# EAGLE design display (EAGLE 6.6.0)
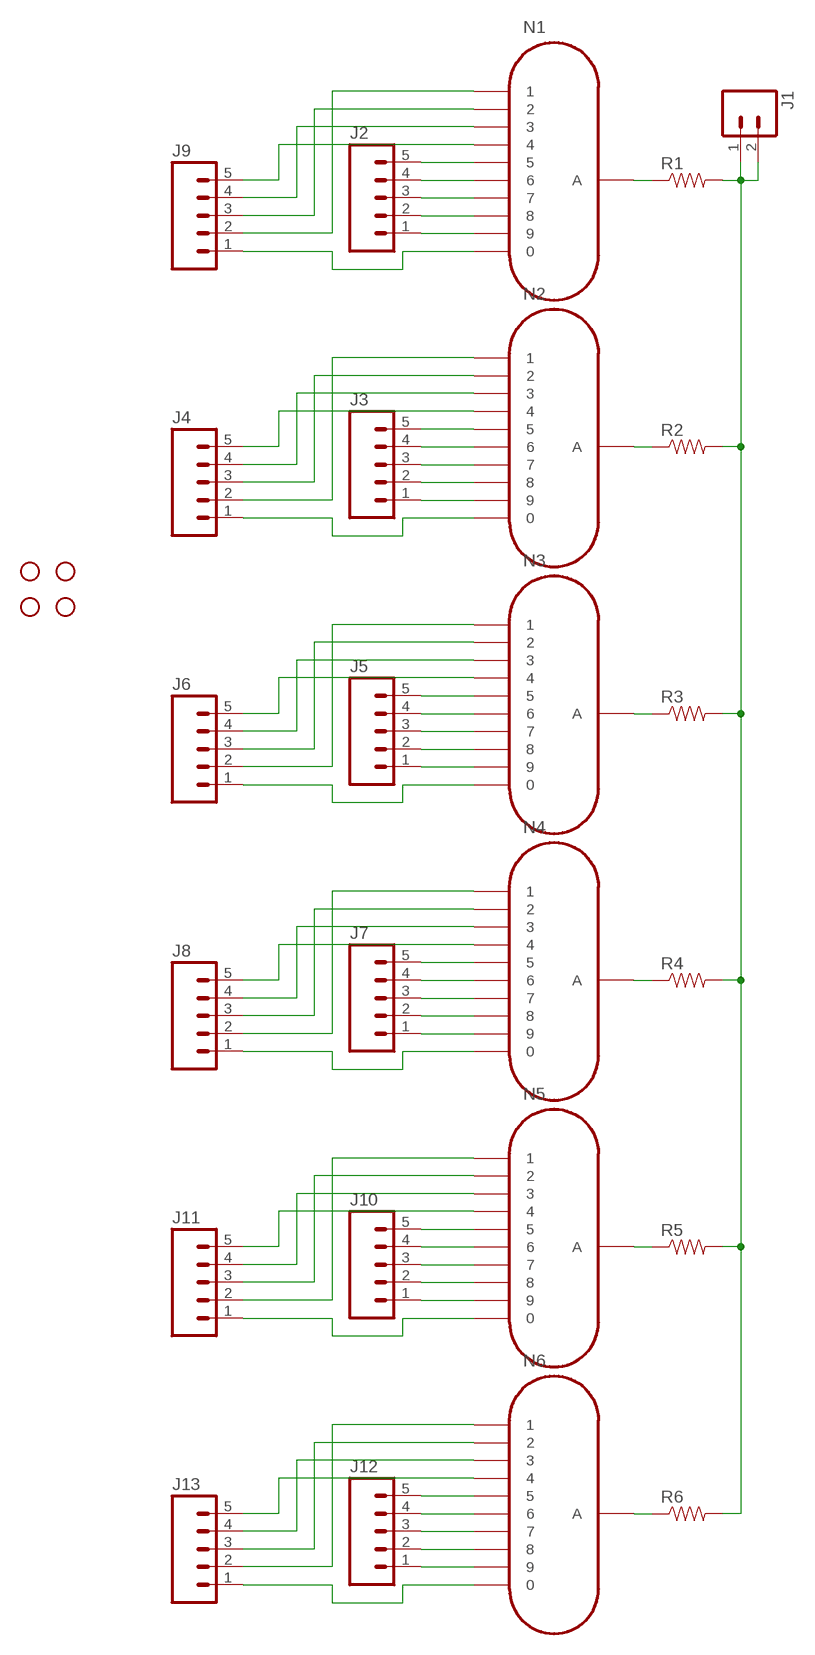
[diagram p0: schematic, sheet 1]

## Parts
H1  STAND-OFF  [STAND-OFF]
H2  STAND-OFF  [STAND-OFF]
H3  STAND-OFF  [STAND-OFF]
H4  STAND-OFF  [STAND-OFF]
J1  M02PTH  [1X02]
J2  M05PTH  [1X05]
J3  M05PTH  [1X05]
J4  M05PTH  [1X05]
J5  M05PTH  [1X05]
J6  M05PTH  [1X05]
J7  M05PTH  [1X05]
J8  M05PTH  [1X05]
J9  M05PTH  [1X05]
J10  M05PTH  [1X05]
J11  M05PTH  [1X05]
J12  M05PTH  [1X05]
J13  M05PTH  [1X05]
N1  IN-12A  [IN-12]
N2  IN-12A  [IN-12]
N3  IN-12A  [IN-12]
N4  IN-12A  [IN-12]
N5  IN-12A  [IN-12]
N6  IN-12A  [IN-12]
R1  RESISTOR0805-RES  [0805]
R2  RESISTOR0805-RES  [0805]
R3  RESISTOR0805-RES  [0805]
R4  RESISTOR0805-RES  [0805]
R5  RESISTOR0805-RES  [0805]
R6  RESISTOR0805-RES  [0805]

## Nets
N$1: J4.1 N2.0
N$2: J3.1 N2.9
N$3: J3.2 N2.8
N$4: J3.3 N2.7
N$5: J3.4 N2.6
N$6: J4.3 N2.2
N$7: J4.4 N2.3
N$8: J4.5 N2.4
N$9: J3.5 N2.5
N$10: J4.2 N2.1
N$11: J2.1 N1.9
N$12: J2.2 N1.8
N$13: J2.3 N1.7
N$14: J2.4 N1.6
N$15: J2.5 N1.5
N$16: J9.2 N1.1
N$17: J9.3 N1.2
N$18: J9.4 N1.3
N$19: J9.5 N1.4
N$20: J9.1 N1.0
N$21: J6.1 N3.0
N$22: J5.1 N3.9
N$23: J5.2 N3.8
N$24: J5.3 N3.7
N$25: J5.4 N3.6
N$26: J5.5 N3.5
N$27: J6.2 N3.1
N$28: J6.3 N3.2
N$29: J6.4 N3.3
N$30: J6.5 N3.4
N$31: J8.1 N4.0
N$32: J7.1 N4.9
N$33: J7.2 N4.8
N$34: J7.3 N4.7
N$35: J7.4 N4.6
N$36: J7.5 N4.5
N$37: J8.2 N4.1
N$38: J8.3 N4.2
N$39: J8.4 N4.3
N$40: J8.5 N4.4
N$41: J11.1 N5.0
N$42: J10.1 N5.9
N$43: J10.2 N5.8
N$44: J10.3 N5.7
N$45: J10.4 N5.6
N$46: J10.5 N5.5
N$47: J11.2 N5.1
N$48: J11.3 N5.2
N$49: J11.4 N5.3
N$50: J11.5 N5.4
N$51: J13.1 N6.0
N$52: J12.1 N6.9
N$53: J12.2 N6.8
N$54: J12.3 N6.7
N$55: J12.4 N6.6
N$56: J12.5 N6.5
N$57: J13.2 N6.1
N$58: J13.3 N6.2
N$59: J13.4 N6.3
N$60: J13.5 N6.4
N$61: N1.A R1.1
N$62: N2.A R2.1
N$63: N3.A R3.1
N$64: N4.A R4.1
N$65: N5.A R5.1
N$66: N6.A R6.1
N$67: J1.1 J1.2 R1.2 R2.2 R3.2 R4.2 R5.2 R6.2

## Library data of the parts
H1-H4 = SparkFun-Electromechanical:STAND-OFF: #4 Stand Off This is the mechanical footprint for a #4 phillips button head screw. Use the keepout ring to avoid running the screw head into surrounding components. SKU : PRT-00447
J1 = SparkFun-Connectors:M02: Standard 2-pin 0.1" header. Use with - straight break away headers ( PRT-00116) - right angle break away headers (PRT-00553) - swiss pins (PRT-00743) - machine pins (PRT-00117) - female headers (PRT-00115) Molex polarized connector foot print use with: PRT-08233 with associated crimp pins and housings. 2.54_SCREWTERM for use with PRT-10571. 3.5mm Screw Terminal footprints for PRT-08084 5mm Screw Terminal footprints for use with PRT-08432
J2-J13 = SparkFun-Connectors:M05: Header 5 Standard 5-pin 0.1" header. Use with straight break away headers (SKU : PRT-00116), right angle break away headers (PRT-00553), swiss pins (PRT-00743), machine pins (PRT-00117), and female headers (PRT-00115). Molex polarized connector foot print use with SKU : PRT-08230 with associated crimp pins and housings.
N1-N6 = russian-nixies:IN-12A: IN-12A: medium numeric topview nixie tube
R1-R6 = SparkFun-Passives:RESISTOR: Resistor Basic schematic elements and footprints for 0603, 1206, and PTH resistors.

## Board
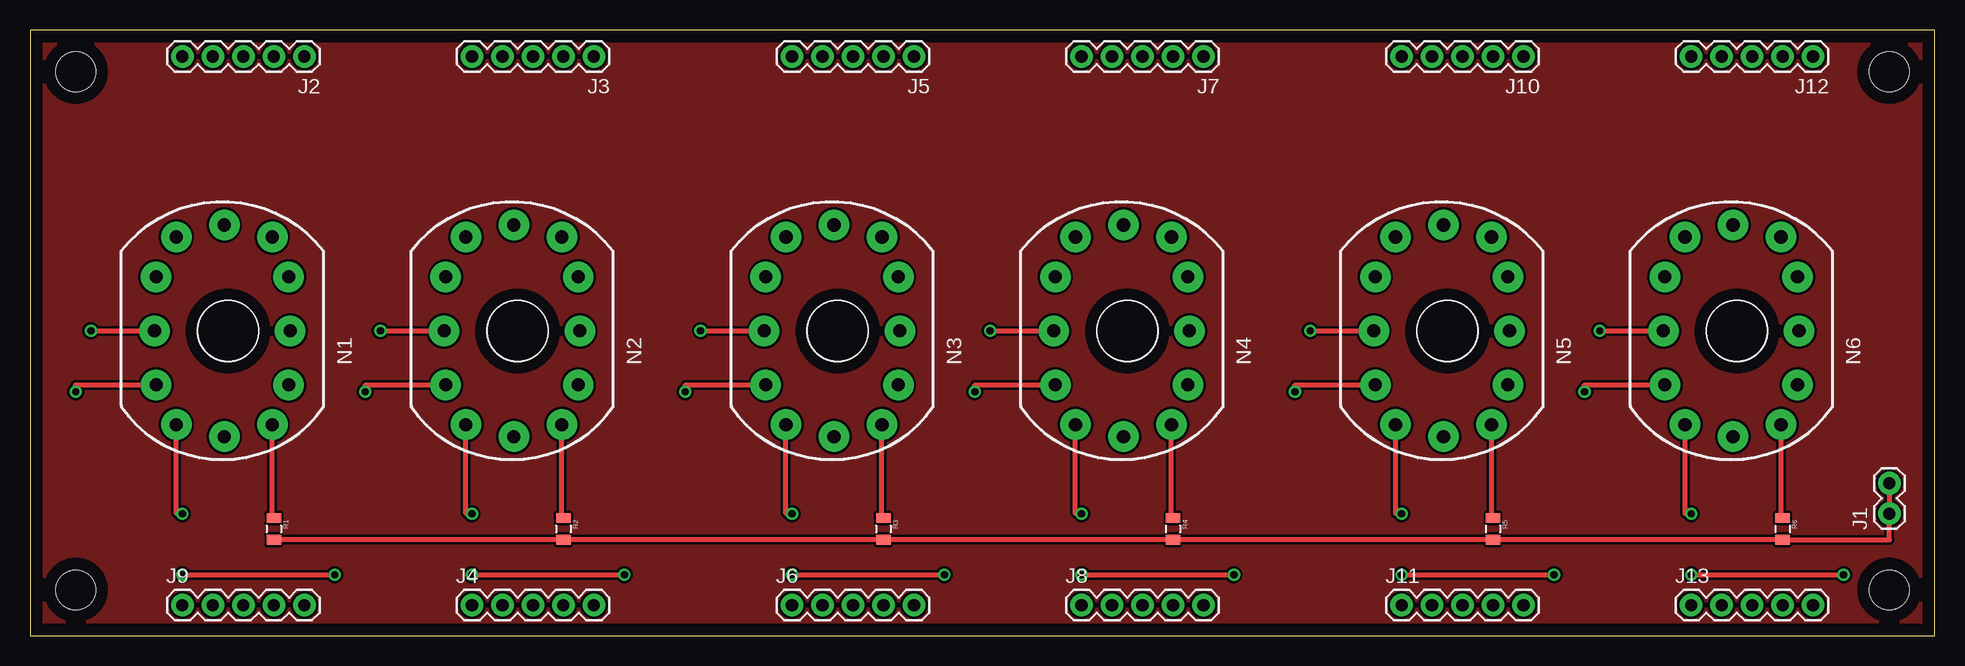
[diagram p1: board, top side]
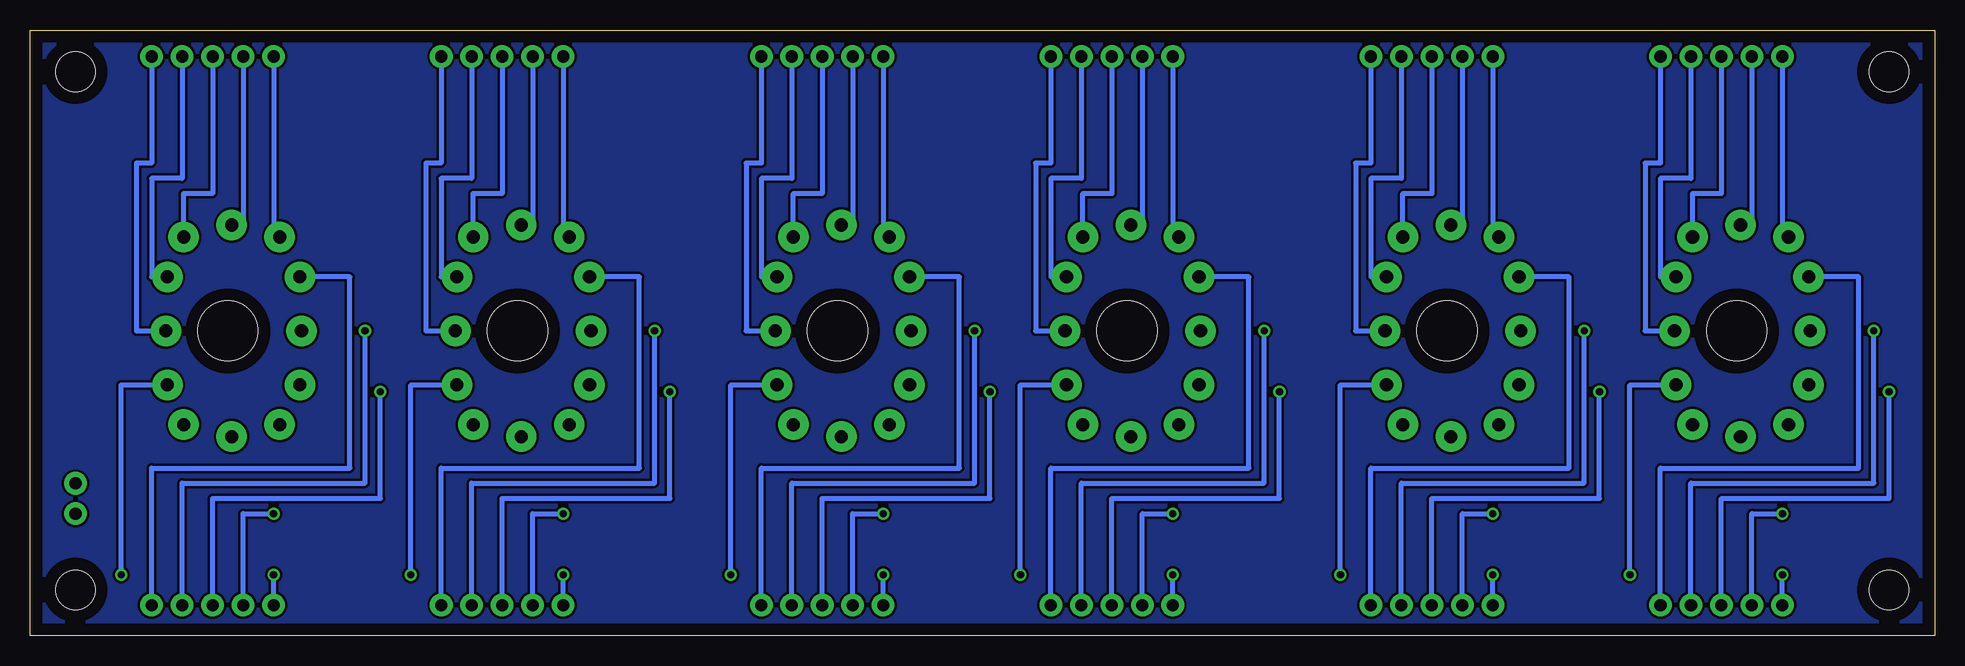
[diagram p2: board, bottom side, seen from below]

Size 158.73 x 50.47 mm. Coordinates in mm from the lower left corner, seen from the top.
Outline: 0,0 158.73,0 158.73,50.47 0,50.47 0,0
Copper layers (1*16): Top 0.035mm / dielectric 1.5mm / Bottom 0.035mm
Design rules "default": minimum track width 10mil, minimum drill 24mil, track to track 8mil, track to pad 8mil, pad to pad 8mil, via to via 8mil, smd to smd 8mil, copper to edge 40mil, drill to drill 8mil, minimum pad ring 10mil, minimum via ring 8mil, stop-mask expansion 4mil, vias tented up to drill 0mil, thermal gap 10mil

### Footprints (pad centres in the part's own frame; a part is rotated, then mirrored left to right if it is on the bottom)
STAND-OFF = hole 3.302: 0,0
1X02 = drill 1.016 pad 1.88: 1 0,0; 2 2.54,0
1X05 = drill 1.016 pad 1.88: 1 0,0; 2 2.54,0; 3 5.08,0; 4 7.62,0; 5 10.16,0
IN-12 = drill 1.1 pad 2.54: 0 5.048,-4.5; 1 -4.317,-7.817; 2 -6,-4.5; 3 -6.127,0; 4 -6,4.5; 5 -4.317,7.817; 6 -0.318,8.818; 7 3.683,7.817; 8 5.048,4.5; 9 5.175,0; A 3.683,-7.817; LHDP -0.318,-8.818 | hole 5: 0,0
0805 = smd 0.8 x 1.2: 1 -0.9,0; 2 0.9,0

### Placement (x,y rotation side)
H1  3.81,3.81 0 top
H2  154.94,46.99 0 top
H3  154.94,3.81 0 top
H4  3.81,46.99 0 top
J1  154.94,10.16 90 top
J2  22.86,48.26 180 top
J3  46.99,48.26 180 top
J4  36.83,2.54 0 top
J5  73.66,48.26 180 top
J6  63.5,2.54 0 top
J7  97.79,48.26 180 top
J8  87.63,2.54 0 top
J9  12.7,2.54 0 top
J10  124.46,48.26 180 top
J11  114.3,2.54 0 top
J12  148.59,48.26 180 top
J13  138.43,2.54 0 top
N1  16.51,25.4 0 top
N2  40.64,25.4 0 top
N3  67.31,25.4 0 top
N4  91.44,25.4 0 top
N5  118.11,25.4 0 top
N6  142.24,25.4 0 top
R1  20.32,8.89 270 top
R2  44.45,8.89 270 top
R3  71.12,8.89 270 top
R4  95.25,8.89 270 top
R5  121.92,8.89 270 top
R6  146.05,8.89 270 top

### Tracks (layer width: path | path; a pad name or v marks a point on that pad's centre or on a via)
GND
  pour Bottom: 0,0 158.75,0 158.75,50.8 0,50.8
N$1  (via drill 0.61)
  Top 0.406: v36.83,5.08 v49.53,5.08
  Bottom 0.406: J4.1 v36.83,5.08 | v49.53,5.08 49.53,20.9 N2.0
N$2
  Bottom 0.406: J3.1 46.99,39.37 48.26,39.37 48.26,25.4 N2.9
N$3
  Bottom 0.406: J3.2 44.45,38.1 46.99,38.1 46.99,29.9 N2.8
N$4
  Bottom 0.406: J3.3 41.91,36.83 44.32,36.83 N2.7
N$5
  Bottom 0.406: J3.4 39.37,34.22 N2.6
N$6  (via drill 0.61)
  Top 0.406: v27.94,20.32 27.94,20.9 N2.2
  Bottom 0.406: J4.3 41.91,11.43 27.94,11.43 v27.94,20.32
N$7  (via drill 0.61)
  Top 0.406: v29.21,25.4 N2.3
  Bottom 0.406: J4.4 44.45,12.7 29.21,12.7 v29.21,25.4
N$8
  Bottom 0.406: J4.5 46.99,13.97 30.48,13.97 30.48,29.9 N2.4
N$9
  Bottom 0.406: J3.5 36.83,33.22 N2.5
N$10  (via drill 0.61)
  Top 0.406: v36.83,10.16 36.32,10.16 N2.1
  Bottom 0.406: J4.2 39.37,10.16 v36.83,10.16
N$11
  Bottom 0.406: J2.1 22.86,39.37 24.13,39.37 24.13,25.4 N1.9
N$12
  Bottom 0.406: J2.2 20.32,38.1 22.86,38.1 22.86,29.9 N1.8
N$13
  Bottom 0.406: J2.3 17.78,36.83 20.19,36.83 N1.7
N$14
  Bottom 0.406: J2.4 15.24,34.22 N1.6
N$15
  Bottom 0.406: J2.5 12.7,33.22 N1.5
N$16  (via drill 0.61)
  Top 0.406: v12.7,10.16 12.19,10.16 N1.1
  Bottom 0.406: J9.2 15.24,10.16 v12.7,10.16
N$17  (via drill 0.61)
  Top 0.406: v3.81,20.32 3.81,20.9 N1.2
  Bottom 0.406: J9.3 17.78,11.43 3.81,11.43 v3.81,20.32
N$18  (via drill 0.61)
  Top 0.406: v5.08,25.4 N1.3
  Bottom 0.406: J9.4 20.32,12.7 5.08,12.7 v5.08,25.4
N$19
  Bottom 0.406: J9.5 22.86,13.97 6.35,13.97 6.35,29.9 N1.4
N$20  (via drill 0.61)
  Top 0.406: v12.7,5.08 v25.4,5.08
  Bottom 0.406: J9.1 v12.7,5.08 | v25.4,5.08 25.4,20.9 N1.0
N$21  (via drill 0.61)
  Top 0.406: v63.5,5.08 v76.2,5.08
  Bottom 0.406: J6.1 v63.5,5.08 | v76.2,5.08 76.2,20.9 N3.0
N$22
  Bottom 0.406: J5.1 73.66,39.37 74.93,39.37 74.93,25.4 N3.9
N$23
  Bottom 0.406: J5.2 71.12,38.1 73.66,38.1 73.66,29.9 N3.8
N$24
  Bottom 0.406: J5.3 68.58,36.83 70.99,36.83 N3.7
N$25
  Bottom 0.406: J5.4 66.04,34.22 N3.6
N$26
  Bottom 0.406: J5.5 63.5,33.22 N3.5
N$27  (via drill 0.61)
  Top 0.406: v63.5,10.16 62.99,10.16 N3.1
  Bottom 0.406: J6.2 66.04,10.16 v63.5,10.16
N$28  (via drill 0.61)
  Top 0.406: v54.61,20.32 54.61,20.9 N3.2
  Bottom 0.406: J6.3 68.58,11.43 54.61,11.43 v54.61,20.32
N$29  (via drill 0.61)
  Top 0.406: v55.88,25.4 N3.3
  Bottom 0.406: J6.4 71.12,12.7 55.88,12.7 v55.88,25.4
N$30
  Bottom 0.406: J6.5 73.66,13.97 57.15,13.97 57.15,29.9 N3.4
N$31  (via drill 0.61)
  Top 0.406: v87.63,5.08 v100.33,5.08
  Bottom 0.406: J8.1 v87.63,5.08 | v100.33,5.08 100.33,20.9 N4.0
N$32
  Bottom 0.406: J7.1 97.79,39.37 99.06,39.37 99.06,25.4 N4.9
N$33
  Bottom 0.406: J7.2 95.25,38.1 97.79,38.1 97.79,29.9 N4.8
N$34
  Bottom 0.406: J7.3 92.71,36.83 95.12,36.83 N4.7
N$35
  Bottom 0.406: J7.4 90.17,34.22 N4.6
N$36
  Bottom 0.406: J7.5 87.63,33.22 N4.5
N$37  (via drill 0.61)
  Top 0.406: v87.63,10.16 87.12,10.16 N4.1
  Bottom 0.406: J8.2 90.17,10.16 v87.63,10.16
N$38  (via drill 0.61)
  Top 0.406: v78.74,20.32 78.74,20.9 N4.2
  Bottom 0.406: J8.3 92.71,11.43 78.74,11.43 v78.74,20.32
N$39  (via drill 0.61)
  Top 0.406: v80.01,25.4 N4.3
  Bottom 0.406: J8.4 95.25,12.7 80.01,12.7 v80.01,25.4
N$40
  Bottom 0.406: J8.5 97.79,13.97 81.28,13.97 81.28,29.9 N4.4
N$41  (via drill 0.61)
  Top 0.406: v114.3,5.08 v127,5.08
  Bottom 0.406: J11.1 v114.3,5.08 | v127,5.08 127,20.9 N5.0
N$42
  Bottom 0.406: J10.1 124.46,39.37 125.73,39.37 125.73,25.4 N5.9
N$43
  Bottom 0.406: J10.2 121.92,38.1 124.46,38.1 124.46,29.9 N5.8
N$44
  Bottom 0.406: J10.3 119.38,36.83 121.79,36.83 N5.7
N$45
  Bottom 0.406: J10.4 116.84,34.22 N5.6
N$46
  Bottom 0.406: J10.5 114.3,33.22 N5.5
N$47  (via drill 0.61)
  Top 0.406: v114.3,10.16 113.79,10.16 N5.1
  Bottom 0.406: J11.2 116.84,10.16 v114.3,10.16
N$48  (via drill 0.61)
  Top 0.406: v105.41,20.32 105.41,20.9 N5.2
  Bottom 0.406: J11.3 119.38,11.43 105.41,11.43 v105.41,20.32
N$49  (via drill 0.61)
  Top 0.406: v106.68,25.4 N5.3
  Bottom 0.406: J11.4 121.92,12.7 106.68,12.7 v106.68,25.4
N$50
  Bottom 0.406: J11.5 124.46,13.97 107.95,13.97 107.95,29.9 N5.4
N$51  (via drill 0.61)
  Top 0.406: v138.43,5.08 v151.13,5.08
  Bottom 0.406: J13.1 v138.43,5.08 | v151.13,5.08 151.13,20.9 N6.0
N$52
  Bottom 0.406: J12.1 148.59,39.37 149.86,39.37 149.86,25.4 N6.9
N$53
  Bottom 0.406: J12.2 146.05,38.1 148.59,38.1 148.59,29.9 N6.8
N$54
  Bottom 0.406: J12.3 143.51,36.83 145.92,36.83 N6.7
N$55
  Bottom 0.406: J12.4 140.97,34.22 N6.6
N$56
  Bottom 0.406: J12.5 138.43,33.22 N6.5
N$57  (via drill 0.61)
  Top 0.406: v138.43,10.16 137.92,10.16 N6.1
  Bottom 0.406: J13.2 140.97,10.16 v138.43,10.16
N$58  (via drill 0.61)
  Top 0.406: v129.54,20.32 129.54,20.9 N6.2
  Bottom 0.406: J13.3 143.51,11.43 129.54,11.43 v129.54,20.32
N$59  (via drill 0.61)
  Top 0.406: v130.81,25.4 N6.3
  Bottom 0.406: J13.4 146.05,12.7 130.81,12.7 v130.81,25.4
N$60
  Bottom 0.406: J13.5 148.59,13.97 132.08,13.97 132.08,29.9 N6.4
N$61
  Top 0.406: R1.1 20.19,9.79 N1.A
N$62
  Top 0.406: R2.1 44.32,9.79 N2.A
N$63
  Top 0.406: R3.1 70.99,9.79 N3.A
N$64
  Top 0.406: R4.1 95.12,9.79 N4.A
N$65
  Top 0.406: R5.1 121.79,9.79 N5.A
N$66
  Top 0.406: R6.1 145.92,9.79 N6.A
N$67
  Top 0.406: J1.2 J1.1 | 154.94,9.26 J1.1 | R1.2 R2.2 R3.2 R4.2 R5.2 R6.2 154.94,7.99 J1.1
N$68
  pour Top: 0,0 158.75,0 158.75,50.8 0,50.8